# Altium schematic sheet 01_interface.SchDoc
size A4
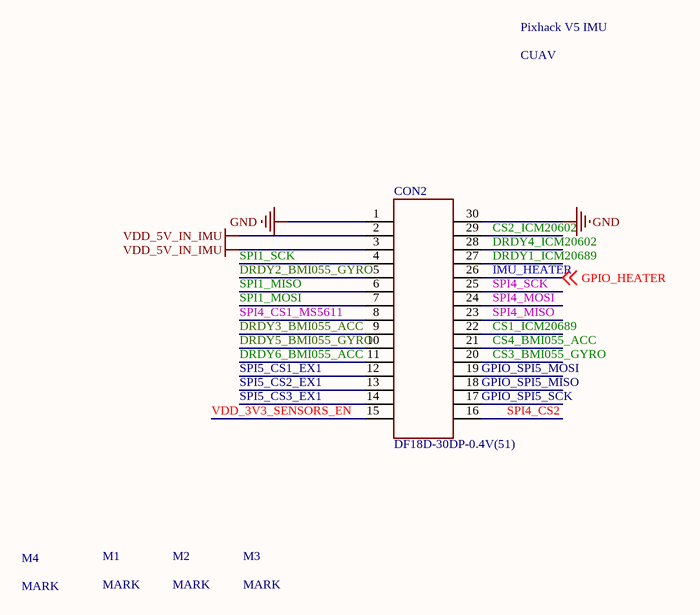
[diagram p0: 01_interface.SchDoc]

## Parts
CON2  DF18D-30DP-0.4V(51)  [DF18D-30DP-0.4V(51)]
M1  MARK  [MARK]
M2  MARK  [MARK]
M3  MARK  [MARK]
M4  MARK  [MARK]
Pixhack_V5_IMU  CUAV  [CUAV]

## Nets
GND: CON2.1 CON2.30
VDD_5V_IN_IMU: CON2.2 CON2.3
CS1_ICM20689: CON2.22
CS2_ICM20602: CON2.29
CS3_BMI055_GYRO: CON2.20
CS4_BMI055_ACC: CON2.21
DRDY1_ICM20689: CON2.27
DRDY2_BMI055_GYRO: CON2.5
DRDY3_BMI055_ACC: CON2.9
DRDY4_ICM20602: CON2.28
DRDY5_BMI055_GYRO: CON2.10
DRDY6_BMI055_ACC: CON2.11
GPIO_SPI5_MISO: CON2.18
GPIO_SPI5_MOSI: CON2.19
GPIO_SPI5_SCK: CON2.17
IMU_HEATER: CON2.26 ; off-sheet GPIO_HEATER  [also labelled GPIO_HEATER]
SPI1_MISO: CON2.6
SPI1_MOSI: CON2.7
SPI1_SCK: CON2.4
SPI4_CS1_MS5611: CON2.8
SPI4_CS2: CON2.16
SPI4_MISO: CON2.23
SPI4_MOSI: CON2.24
SPI4_SCK: CON2.25
SPI5_CS1_EX1: CON2.12
SPI5_CS2_EX1: CON2.13
SPI5_CS3_EX1: CON2.14
VDD_3V3_SENSORS_EN: CON2.15